# Altium schematic sheet DDR3 - POWER.SchDoc
size A4; DocumentNumber: 11; SheetNumber: 11; SheetTotal: 17
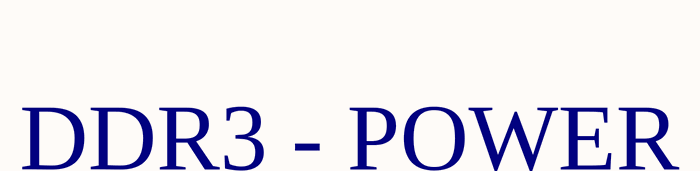
[diagram p0: DDR3 - POWER.SchDoc]

## Notes on the sheet
- DDR3 - POWER